# EAGLE schematic pcb (EAGLE 6.5.0)
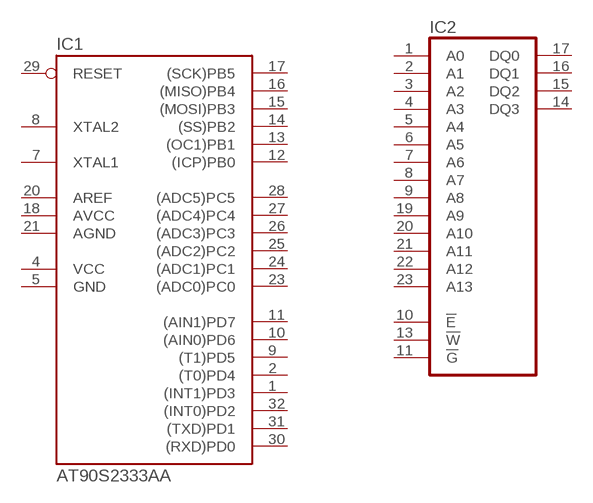
[diagram p0: schematic, sheet 1]

## Parts
IC1  AT90S2333AA  [TQFP32-08]
IC2  MCM6290C  [SOJ24/3]
Unconnected: IC1.1((INT1)PD3) IC1.2((T0)PD4) IC1.3(NC1) IC1.6(NC2) IC1.7(XTAL1) IC1.8(XTAL2) IC1.9((T1)PD5) IC1.10((AIN0)PD6) IC1.11((AIN1)PD7) IC1.12((ICP)PB0) IC1.13((OC1)PB1) IC1.14((SS)PB2) IC1.15((MOSI)PB3) IC1.16((MISO)PB4) IC1.17((SCK)PB5) IC1.19(NC3) IC1.20(AREF) IC1.22(NC4) IC1.23((ADC0)PC0) IC1.24((ADC1)PC1) IC1.25((ADC2)PC2) IC1.26((ADC3)PC3) IC1.27((ADC4)PC4) IC1.28((ADC5)PC5) IC1.29(RESET) IC1.30((RXD)PD0) IC1.31((TXD)PD1) IC1.32((INT0)PD2) IC2.1(A0) IC2.2(A1) IC2.3(A2) IC2.4(A3) IC2.5(A4) IC2.6(A5) IC2.7(A6) IC2.8(A7) IC2.9(A8) IC2.10(!E) IC2.11(!G) IC2.13(!W) IC2.14(DQ3) IC2.15(DQ2) IC2.16(DQ1) IC2.17(DQ0) IC2.19(A9) IC2.20(A10) IC2.21(A11) IC2.22(A12) IC2.23(A13)

## Power pins joined to a net without a drawn wire
AGND: IC1.21(AGND)
AVCC: IC1.18(AVCC)
GND: IC1.5(GND) IC2.12(GND)
VCC: IC1.4(VCC) IC2.24(VCC)

## Library data of the parts
IC1 = atmel:AT90S2333A: MICROCONTROLLER 2 Kbytes FLASH 128 bytes SRAM 128 bytes EEPROM UART 6-channel 10-bit ADC; OC_FARNELL: unknown; OC_NEWARK: unknown
IC2 = memory-sram:MCM6290C: MEMORY